# EAGLE design stm32f4-discovery-breakout-v1 (EAGLE 6.5.0)
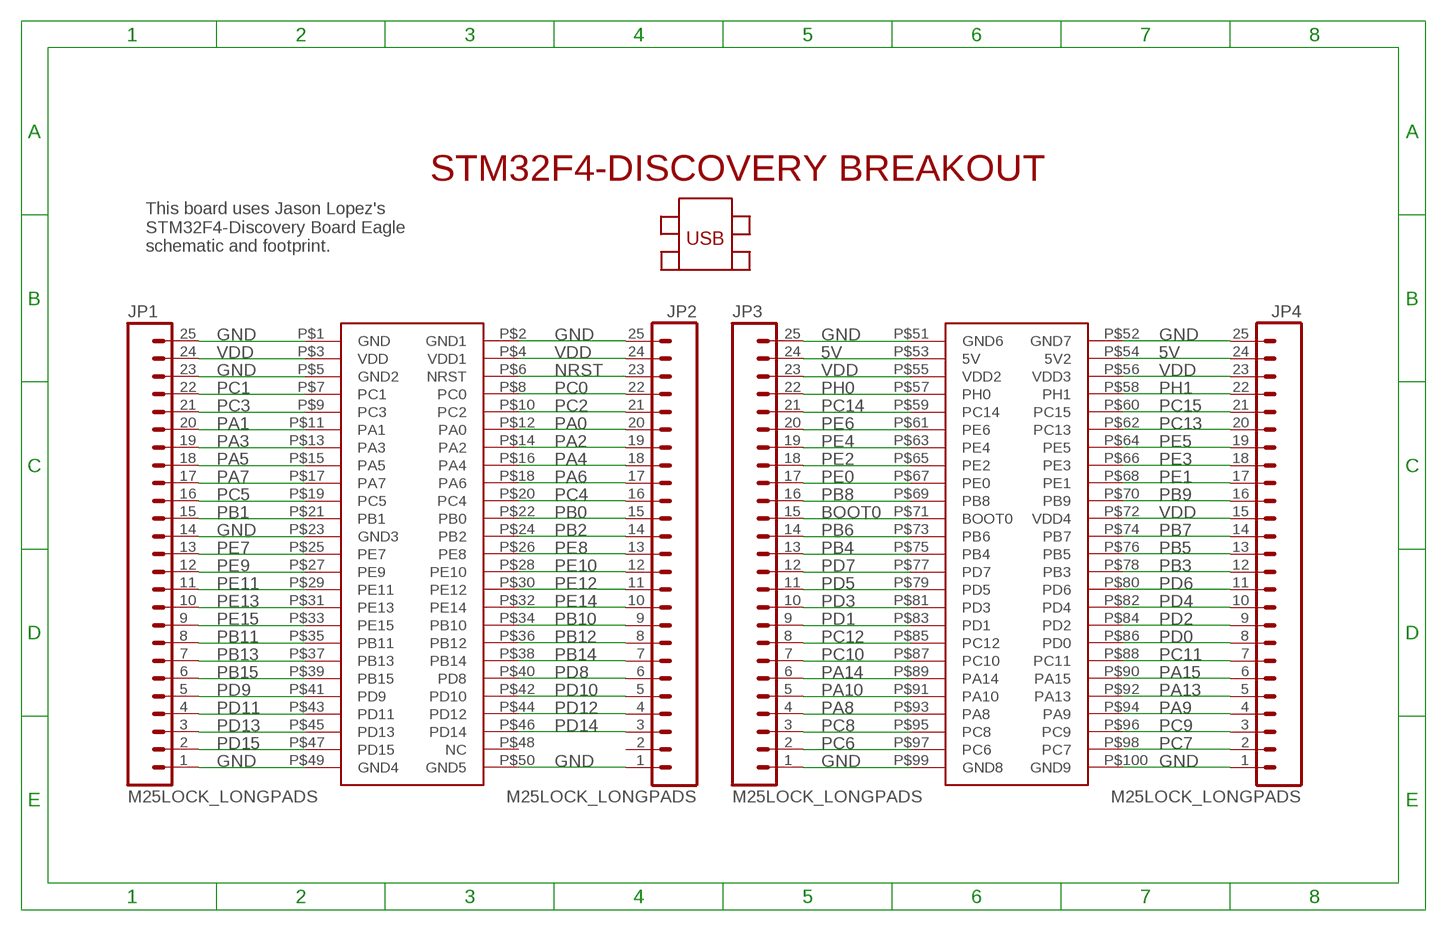
[diagram p0: schematic, sheet 1]

## Parts
JP1  M25LOCK_LONGPADS  [1X25_LOCK_LONGPADS]
JP2  M25LOCK_LONGPADS  [1X25_LOCK_LONGPADS]
JP3  M25LOCK_LONGPADS  [1X25_LOCK_LONGPADS]
JP4  M25LOCK_LONGPADS  [1X25_LOCK_LONGPADS]
U$1  STM32F4-DISCOVERY  [STM32F4-DISCOVERY]

## Nets
5V: JP3.24 JP4.24 U$1.P$53(5V) U$1.P$54(5V2)
BOOT0: JP3.15 U$1.P$71(BOOT0)
GND: JP1.1 JP1.14 JP1.23 JP1.25 JP2.1 JP2.25 JP3.1 JP3.25 JP4.1 JP4.25 U$1.P$1(GND) U$1.P$2(GND1) U$1.P$5(GND2) U$1.P$23(GND3) U$1.P$49(GND4) U$1.P$50(GND5) U$1.P$51(GND6) U$1.P$52(GND7) U$1.P$99(GND8) U$1.P$100(GND9)
NRST: JP2.23 U$1.P$6(NRST)
PA0: JP2.20 U$1.P$12(PA0)
PA1: JP1.20 U$1.P$11(PA1)
PA2: JP2.19 U$1.P$14(PA2)
PA3: JP1.19 U$1.P$13(PA3)
PA4: JP2.18 U$1.P$16(PA4)
PA5: JP1.18 U$1.P$15(PA5)
PA6: JP2.17 U$1.P$18(PA6)
PA7: JP1.17 U$1.P$17(PA7)
PA8: JP3.4 U$1.P$93(PA8)
PA9: JP4.4 U$1.P$94(PA9)
PA10: JP3.5 U$1.P$91(PA10)
PA13: JP4.5 U$1.P$92(PA13)
PA14: JP3.6 U$1.P$89(PA14)
PA15: JP4.6 U$1.P$90(PA15)
PB0: JP2.15 U$1.P$22(PB0)
PB1: JP1.15 U$1.P$21(PB1)
PB2: JP2.14 U$1.P$24(PB2)
PB3: JP4.12 U$1.P$78(PB3)
PB4: JP3.13 U$1.P$75(PB4)
PB5: JP4.13 U$1.P$76(PB5)
PB6: JP3.14 U$1.P$73(PB6)
PB7: JP4.14 U$1.P$74(PB7)
PB8: JP3.16 U$1.P$69(PB8)
PB9: JP4.16 U$1.P$70(PB9)
PB10: JP2.9 U$1.P$34(PB10)
PB11: JP1.8 U$1.P$35(PB11)
PB12: JP2.8 U$1.P$36(PB12)
PB13: JP1.7 U$1.P$37(PB13)
PB14: JP2.7 U$1.P$38(PB14)
PB15: JP1.6 U$1.P$39(PB15)
PC0: JP2.22 U$1.P$8(PC0)
PC1: JP1.22 U$1.P$7(PC1)
PC2: JP2.21 U$1.P$10(PC2)
PC3: JP1.21 U$1.P$9(PC3)
PC4: JP2.16 U$1.P$20(PC4)
PC5: JP1.16 U$1.P$19(PC5)
PC6: JP3.2 U$1.P$97(PC6)
PC7: JP4.2 U$1.P$98(PC7)
PC8: JP3.3 U$1.P$95(PC8)
PC9: JP4.3 U$1.P$96(PC9)
PC10: JP3.7 U$1.P$87(PC10)
PC11: JP4.7 U$1.P$88(PC11)
PC12: JP3.8 U$1.P$85(PC12)
PC13: JP4.20 U$1.P$62(PC13)
PC14: JP3.21 U$1.P$59(PC14)
PC15: JP4.21 U$1.P$60(PC15)
PD0: JP4.8 U$1.P$86(PD0)
PD1: JP3.9 U$1.P$83(PD1)
PD2: JP4.9 U$1.P$84(PD2)
PD3: JP3.10 U$1.P$81(PD3)
PD4: JP4.10 U$1.P$82(PD4)
PD5: JP3.11 U$1.P$79(PD5)
PD6: JP4.11 U$1.P$80(PD6)
PD7: JP3.12 U$1.P$77(PD7)
PD8: JP2.6 U$1.P$40(PD8)
PD9: JP1.5 U$1.P$41(PD9)
PD10: JP2.5 U$1.P$42(PD10)
PD11: JP1.4 U$1.P$43(PD11)
PD12: JP2.4 U$1.P$44(PD12)
PD13: JP1.3 U$1.P$45(PD13)
PD14: JP2.3 U$1.P$46(PD14)
PD15: JP1.2 U$1.P$47(PD15)
PE0: JP3.17 U$1.P$67(PE0)
PE1: JP4.17 U$1.P$68(PE1)
PE2: JP3.18 U$1.P$65(PE2)
PE3: JP4.18 U$1.P$66(PE3)
PE4: JP3.19 U$1.P$63(PE4)
PE5: JP4.19 U$1.P$64(PE5)
PE6: JP3.20 U$1.P$61(PE6)
PE7: JP1.13 U$1.P$25(PE7)
PE8: JP2.13 U$1.P$26(PE8)
PE9: JP1.12 U$1.P$27(PE9)
PE10: JP2.12 U$1.P$28(PE10)
PE11: JP1.11 U$1.P$29(PE11)
PE12: JP2.11 U$1.P$30(PE12)
PE13: JP1.10 U$1.P$31(PE13)
PE14: JP2.10 U$1.P$32(PE14)
PE15: JP1.9 U$1.P$33(PE15)
PH0: JP3.22 U$1.P$57(PH0)
PH1: JP4.22 U$1.P$58(PH1)
VDD: JP1.24 JP2.24 JP3.23 JP4.15 JP4.23 U$1.P$3(VDD) U$1.P$4(VDD1) U$1.P$55(VDD2) U$1.P$56(VDD3) U$1.P$72(VDD4)
Unconnected: JP2.2 U$1.P$48(NC)

## Notes on the sheet
- This board uses Jason Lopez's
  STM32F4-Discovery Board Eagle 
  schematic and footprint.

## Library data of the parts
JP1-JP4 = SparkFun-Connectors:M25: 1x25 .1" header
U$1 = STM32F4-DISCOVERY:STM32F4-DISCOVERY

## Board
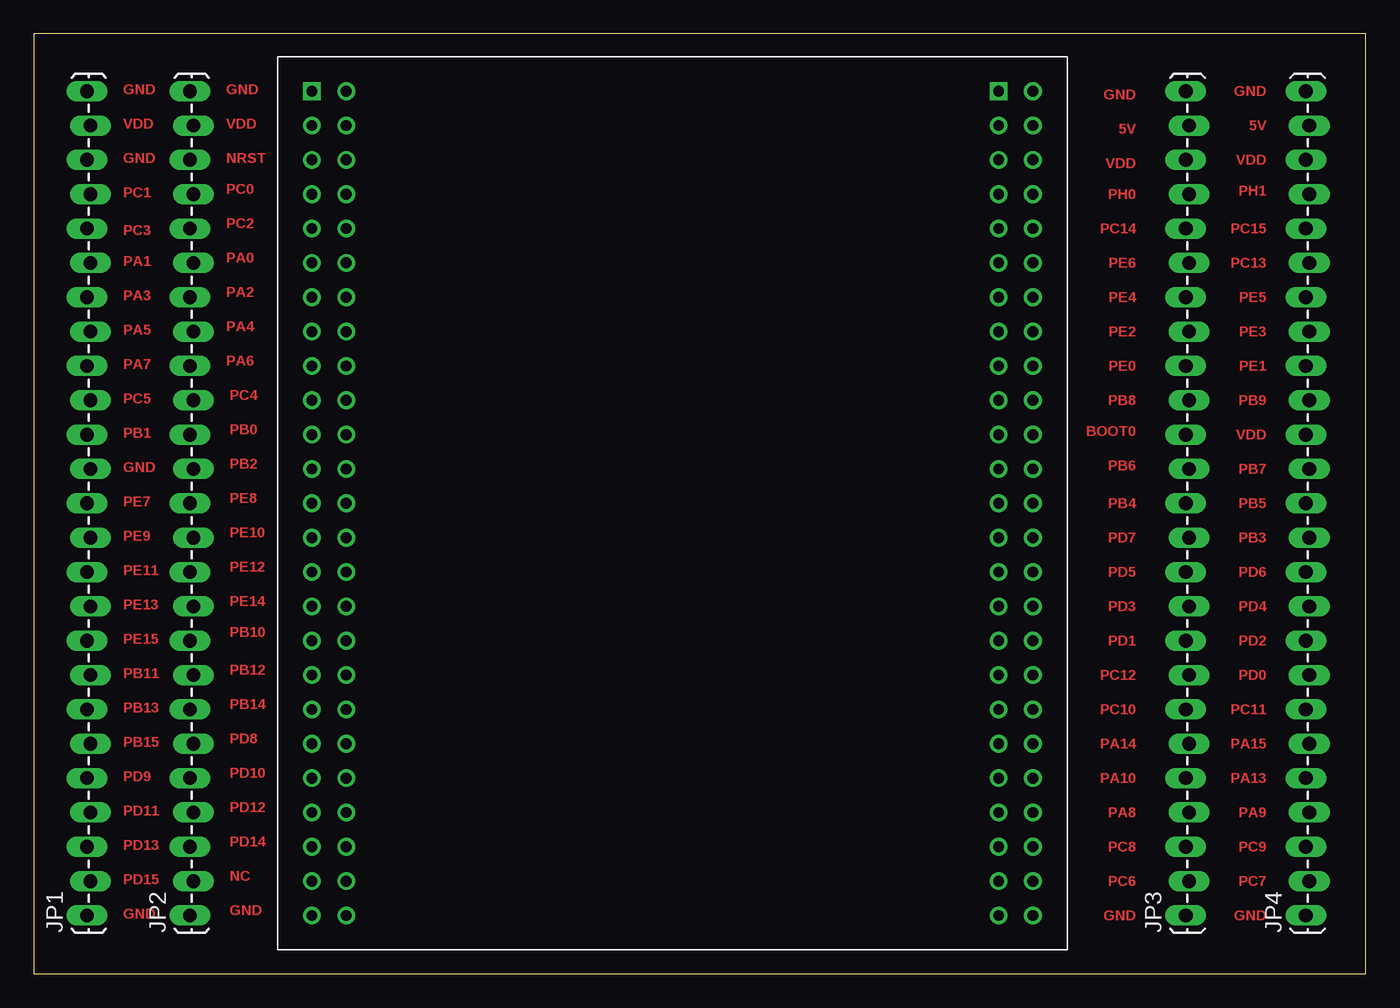
[diagram p1: board, top side]
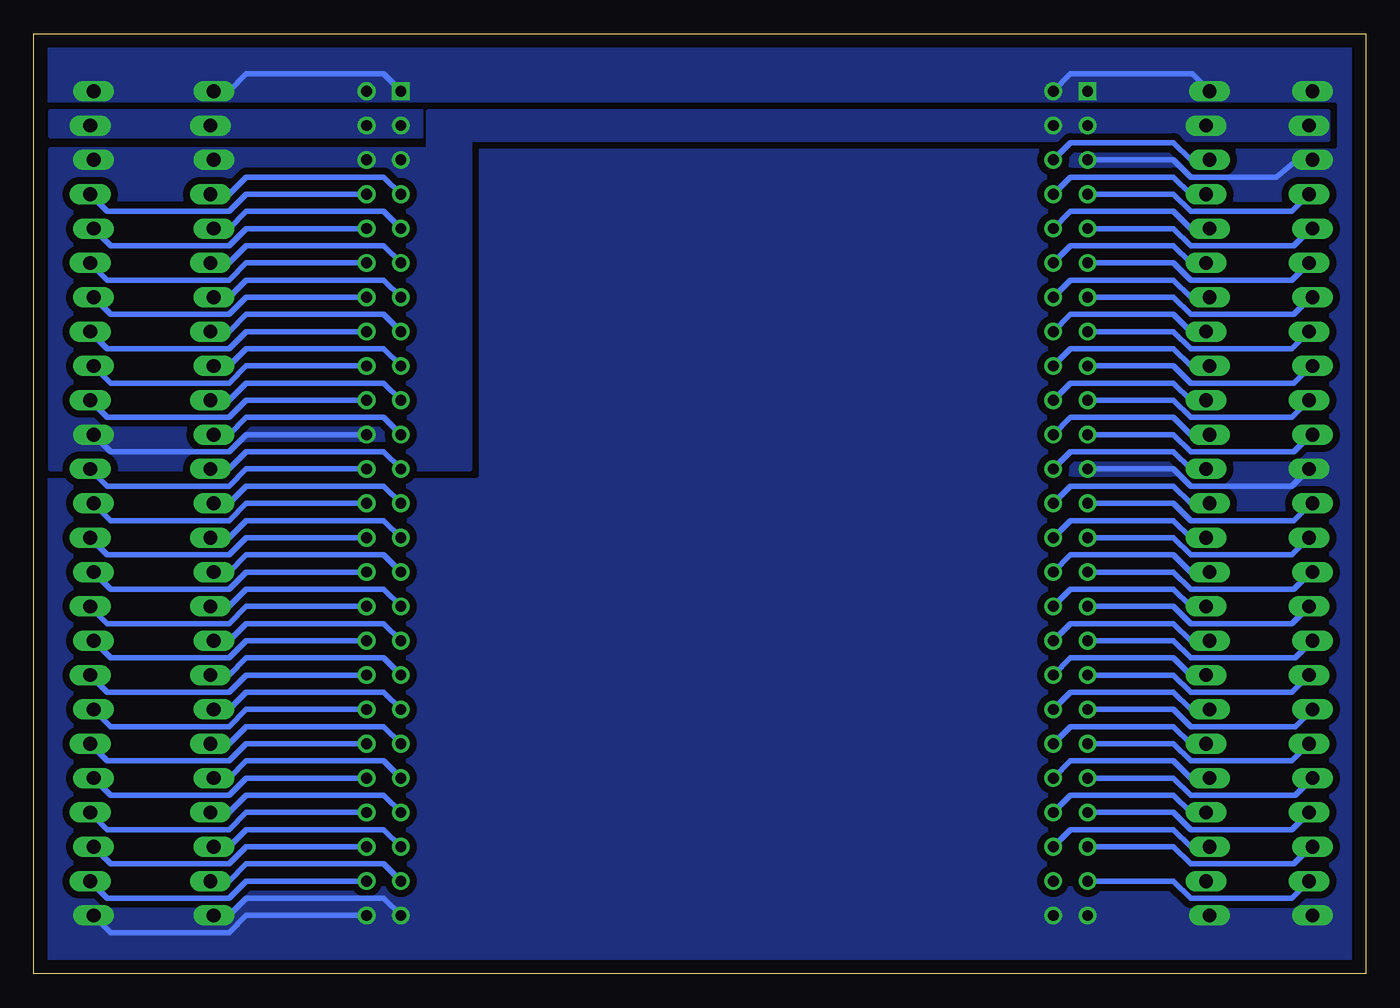
[diagram p2: board, bottom side, seen from below]

Size 98.53 x 69.52 mm. Coordinates in mm from the lower left corner, seen from the top.
Outline: 0,0 98.53,0 98.53,69.52 0,69.52 0,0
Copper layers (1*16): Top 0.035mm / dielectric 1.5mm / Bottom 0.035mm
Design rules "default": minimum track width 10mil, minimum drill 24mil, track to track 8mil, track to pad 8mil, pad to pad 8mil, via to via 8mil, smd to smd 8mil, copper to edge 40mil, drill to drill 8mil, minimum pad ring 10mil, minimum via ring 8mil, stop-mask expansion 4mil, vias tented up to drill 0mil, thermal gap 10mil

### Footprints (pad centres in the part's own frame; a part is rotated, then mirrored left to right if it is on the bottom)
1X25_LOCK_LONGPADS = drill 1.016 long: 1 0,0.127; 2 2.54,-0.127; 3 5.08,0.127; 4 7.62,-0.127; 5 10.16,0.127; 6 12.7,-0.127; 7 15.24,0.127; 8 17.78,-0.127; 9 20.32,0.127; 10 22.86,-0.127; 11 25.4,0.127; 12 27.94,-0.127; 13 30.48,0.127; 14 33.02,-0.127; 15 35.56,0.127; 16 38.1,-0.127; 17 40.64,0.127; 18 43.18,-0.127; 19 45.72,0.127; 20 48.26,-0.127; 21 50.8,0.127; 22 53.34,-0.127; 23 55.88,0.127; 24 58.42,-0.127; 25 60.96,0.127
STM32F4-DISCOVERY = drill 0.8 square: P$1 -27.94,30.48; P$51 22.86,30.48 | drill 0.8: P$2 -25.4,30.48; P$3 -27.94,27.94; P$4 -25.4,27.94; P$5 -27.94,25.4; P$6 -25.4,25.4; P$7 -27.94,22.86; P$8 -25.4,22.86; P$9 -27.94,20.32; P$10 -25.4,20.32; P$11 -27.94,17.78; P$12 -25.4,17.78; P$13 -27.94,15.24; P$14 -25.4,15.24; P$15 -27.94,12.7; P$16 -25.4,12.7; P$17 -27.94,10.16; P$18 -25.4,10.16; P$19 -27.94,7.62; P$20 -25.4,7.62; P$21 -27.94,5.08; P$22 -25.4,5.08; P$23 -27.94,2.54; P$24 -25.4,2.54; P$25 -27.94,0; P$26 -25.4,0; P$27 -27.94,-2.54; P$28 -25.4,-2.54; P$29 -27.94,-5.08; P$30 -25.4,-5.08; P$31 -27.94,-7.62; P$32 -25.4,-7.62; P$33 -27.94,-10.16; P$34 -25.4,-10.16; P$35 -27.94,-12.7; P$36 -25.4,-12.7; P$37 -27.94,-15.24; P$38 -25.4,-15.24; P$39 -27.94,-17.78; P$40 -25.4,-17.78; P$41 -27.94,-20.32; P$42 -25.4,-20.32; P$43 -27.94,-22.86; P$44 -25.4,-22.86; P$45 -27.94,-25.4; P$46 -25.4,-25.4; P$47 -27.94,-27.94; P$48 -25.4,-27.94; P$49 -27.94,-30.48; P$50 -25.4,-30.48; P$52 25.4,30.48; P$53 22.86,27.94; P$54 25.4,27.94; P$55 22.86,25.4; P$56 25.4,25.4; P$57 22.86,22.86; P$58 25.4,22.86; P$59 22.86,20.32; P$60 25.4,20.32; P$61 22.86,17.78; P$62 25.4,17.78; P$63 22.86,15.24; P$64 25.4,15.24; P$65 22.86,12.7; P$66 25.4,12.7; P$67 22.86,10.16; P$68 25.4,10.16; P$69 22.86,7.62; P$70 25.4,7.62; P$71 22.86,5.08; P$72 25.4,5.08; P$73 22.86,2.54; P$74 25.4,2.54; P$75 22.86,0; P$76 25.4,0; P$77 22.86,-2.54; P$78 25.4,-2.54; P$79 22.86,-5.08; P$80 25.4,-5.08; P$81 22.86,-7.62; P$82 25.4,-7.62; P$83 22.86,-10.16; P$84 25.4,-10.16; P$85 22.86,-12.7; P$86 25.4,-12.7; P$87 22.86,-15.24; P$88 25.4,-15.24; P$89 22.86,-17.78; P$90 25.4,-17.78; P$91 22.86,-20.32; P$92 25.4,-20.32; P$93 22.86,-22.86; P$94 25.4,-22.86; P$95 22.86,-25.4; P$96 25.4,-25.4; P$97 22.86,-27.94; P$98 25.4,-27.94; P$99 22.86,-30.48; P$100 25.4,-30.48

### Placement (x,y rotation side)
JP1  4.06,4.32 90 top
JP2  11.68,4.32 90 top
JP3  85.34,4.32 90 top
JP4  94.23,4.32 90 top
U$1  48.51,34.8 0 top

### Tracks (layer width: path | path; a pad name or v marks a point on that pad's centre or on a via)
5V
  pour Bottom (rank 2, no thermals): 69.85,63.75 69.85,61.98 97.28,61.98 97.28,63.75
BOOT0
  Bottom 0.406: U$1.P$71 72.64,41.15 82.8,41.15 84.07,39.88 JP3.15
GND
  Bottom 0.406: U$1.P$2 21.84,66.55 12.83,66.55 JP2.25 | U$1.P$23 14.22,37.34 12.95,36.07 5.46,36.07 JP1.14 | U$1.P$100 82.8,4.32 84.07,3.05 92.84,3.05 JP4.1 | U$1.P$99 72.64,5.59 82.8,5.59 84.07,4.32 JP3.1 | U$1.P$51 72.64,66.55 82.8,66.55 84.07,65.28 JP3.25 | U$1.P$5 14.22,60.2 12.95,58.93 6.6,58.93 5.08,60.2 JP1.23
  pour Bottom (isolate 0.508, rank 3, no thermals): 0.25,69.09 0.25,0.51 98.04,0.51 98.04,69.09
NRST
  Bottom 0.406: U$1.P$6 21.84,61.47 14.22,61.47 12.95,60.2 JP2.23
PA0
  Bottom 0.406: U$1.P$12 21.84,53.85 14.22,53.85 12.95,52.58 JP2.20 11.68,52.58
PA1
  Bottom 0.406: U$1.P$11 14.22,52.58 12.95,51.31 5.46,51.31 JP1.20
PA2
  Bottom 0.406: U$1.P$14 21.84,51.31 14.22,51.31 12.95,50.04 JP2.19
PA3
  Bottom 0.406: U$1.P$13 14.22,50.04 12.95,48.77 5.33,48.77 4.06,50.04 JP1.19
PA4
  Bottom 0.406: U$1.P$16 21.84,48.77 14.22,48.77 12.95,47.5 JP2.18 11.68,47.5
PA5
  Bottom 0.406: U$1.P$15 14.22,47.5 12.95,46.23 5.46,46.23 JP1.18
PA6
  Bottom 0.406: U$1.P$18 21.84,46.23 14.22,46.23 12.95,44.96 JP2.17
PA7
  Bottom 0.406: U$1.P$17 14.22,44.96 12.95,43.69 5.33,43.69 4.06,44.96 JP1.17
PA8
  Bottom 0.406: U$1.P$93 72.64,13.21 82.8,13.21 84.07,11.94 JP3.4
PA9
  Bottom 0.406: U$1.P$94 82.8,11.94 84.07,10.67 93.09,10.67 JP4.4
PA10
  Bottom 0.406: U$1.P$91 72.64,15.75 82.8,15.75 84.07,14.48 JP3.5
PA13
  Bottom 0.406: U$1.P$92 82.8,14.48 84.07,13.21 92.84,13.21 JP4.5
PA14
  Bottom 0.406: U$1.P$89 72.64,18.29 82.8,18.29 84.07,17.02 JP3.6
PA15
  Bottom 0.406: U$1.P$90 82.8,17.02 84.07,15.75 93.09,15.75 JP4.6
PB0
  Bottom 0.406: U$1.P$22 21.84,41.15 14.22,41.15 12.95,39.88 JP2.15
PB1
  Bottom 0.406: U$1.P$21 14.22,39.88 12.95,38.61 5.33,38.61 4.06,39.88 JP1.15
PB2
  Bottom 0.406: U$1.P$24 21.84,38.61 14.22,38.61 12.95,37.34 JP2.14
PB3
  Bottom 0.406: U$1.P$78 82.8,32.26 84.07,30.99 93.09,30.99 JP4.12
PB4
  Bottom 0.406: U$1.P$75 72.64,36.07 82.8,36.07 84.07,34.8 JP3.13
PB5
  Bottom 0.406: U$1.P$76 82.8,34.8 84.07,33.53 92.84,33.53 JP4.13
PB6
  Bottom 0.406: U$1.P$73 72.64,38.61 82.8,38.61 84.07,37.34 JP3.14
PB7
  Bottom 0.406: U$1.P$74 82.8,37.34 84.07,36.07 93.09,36.07 JP4.14
PB8
  Bottom 0.406: U$1.P$69 72.64,43.69 82.8,43.69 84.07,42.42 JP3.16
PB9
  Bottom 0.406: U$1.P$70 82.8,42.42 84.07,41.15 93.09,41.15 JP4.16
PB10
  Bottom 0.406: U$1.P$34 21.84,25.91 14.22,25.91 12.95,24.64 JP2.9
PB11
  Bottom 0.406: U$1.P$35 14.22,22.1 12.95,20.83 5.46,20.83 JP1.8
PB12
  Bottom 0.406: U$1.P$36 21.84,23.37 14.22,23.37 12.95,22.1 JP2.8
PB13
  Bottom 0.406: U$1.P$37 14.22,19.56 12.95,18.29 5.21,18.29 JP1.7
PB14
  Bottom 0.406: U$1.P$38 21.84,20.83 14.22,20.83 12.95,19.56 JP2.7
PB15
  Bottom 0.406: U$1.P$39 14.22,17.02 12.95,15.75 5.46,15.75 JP1.6
PC0
  Bottom 0.406: U$1.P$8 21.84,58.93 14.22,58.93 12.95,57.66 JP2.22
PC1
  Bottom 0.406: U$1.P$7 14.22,57.66 12.95,56.39 5.46,56.39 JP1.22
PC2
  Bottom 0.406: U$1.P$10 21.84,56.39 14.22,56.39 12.95,55.12 JP2.21
PC3
  Bottom 0.406: U$1.P$9 14.22,55.12 12.95,53.85 5.33,53.85 4.06,55.12 JP1.21
PC4
  Bottom 0.406: U$1.P$20 21.84,43.69 14.22,43.69 12.95,42.42 JP2.16
PC5
  Bottom 0.406: U$1.P$19 14.22,42.42 12.95,41.15 5.46,41.15 JP1.16
PC6
  Bottom 0.406: U$1.P$97 72.64,8.13 82.8,8.13 84.07,6.86 JP3.2
PC7
  Bottom 0.406: U$1.P$98 82.8,6.86 84.07,5.59 93.09,5.59 JP4.2
PC8
  Bottom 0.406: U$1.P$95 72.64,10.67 82.8,10.67 84.07,9.4 JP3.3
PC9
  Bottom 0.406: U$1.P$96 82.8,9.4 84.07,8.13 92.84,8.13 JP4.3
PC10
  Bottom 0.406: U$1.P$87 72.64,20.83 82.8,20.83 84.07,19.56 JP3.7 85.34,19.56
PC11
  Bottom 0.406: U$1.P$88 82.8,19.56 84.07,18.29 92.84,18.29 JP4.7
PC12
  Bottom 0.406: U$1.P$85 72.64,23.37 82.8,23.37 84.07,22.1 JP3.8
PC13
  Bottom 0.406: U$1.P$62 82.8,52.58 84.07,51.31 93.09,51.31 JP4.20
PC14
  Bottom 0.406: U$1.P$59 72.64,56.39 82.8,56.39 84.07,55.12 JP3.21
PC15
  Bottom 0.406: U$1.P$60 82.8,55.12 84.07,53.85 92.84,53.85 JP4.21
PD0
  Bottom 0.406: U$1.P$86 82.8,22.1 84.07,20.83 93.09,20.83 JP4.8
PD1
  Bottom 0.406: U$1.P$83 72.64,25.91 82.8,25.91 84.07,24.64 JP3.9
PD2
  Bottom 0.406: U$1.P$84 82.8,24.64 84.07,23.37 92.84,23.37 JP4.9
PD3
  Bottom 0.406: U$1.P$81 72.64,28.45 82.8,28.45 84.07,27.18 JP3.10
PD4
  Bottom 0.406: U$1.P$82 82.8,27.18 84.07,25.91 93.09,25.91 JP4.10
PD5
  Bottom 0.406: U$1.P$79 72.64,30.99 82.8,30.99 84.07,29.72 JP3.11
PD6
  Bottom 0.406: U$1.P$80 82.8,29.72 84.07,28.45 92.84,28.45 JP4.11
PD7
  Bottom 0.406: U$1.P$77 72.64,33.53 82.8,33.53 84.07,32.26 JP3.12
PD8
  Bottom 0.406: U$1.P$40 21.84,18.29 14.22,18.29 12.95,17.02 JP2.6
PD9
  Bottom 0.406: U$1.P$41 14.22,14.48 12.95,13.21 5.21,13.21 JP1.5
PD10
  Bottom 0.406: U$1.P$42 21.84,15.75 14.22,15.75 12.95,14.48 JP2.5
PD11
  Bottom 0.406: U$1.P$43 14.22,11.94 12.95,10.67 5.46,10.67 JP1.4
PD12
  Bottom 0.406: U$1.P$44 21.84,13.21 14.22,13.21 12.95,11.94 JP2.4
PD13
  Bottom 0.406: U$1.P$45 14.22,9.4 12.95,8.13 5.33,8.13 4.06,9.4 JP1.3
PD14
  Bottom 0.406: U$1.P$46 21.84,10.67 14.22,10.67 12.95,9.4 JP2.3
PD15
  Bottom 0.406: U$1.P$47 14.22,6.86 12.95,5.59 5.46,5.59 JP1.2
PE0
  Bottom 0.406: U$1.P$67 72.64,46.23 82.8,46.23 84.07,44.96 JP3.17
PE1
  Bottom 0.406: U$1.P$68 82.8,44.96 84.07,43.69 92.84,43.69 JP4.17
PE2
  Bottom 0.406: U$1.P$65 72.64,48.77 82.8,48.77 84.07,47.5 JP3.18
PE3
  Bottom 0.406: U$1.P$66 82.8,47.5 84.07,46.23 93.09,46.23 JP4.18
PE4
  Bottom 0.406: U$1.P$63 72.64,51.31 82.8,51.31 84.07,50.04 JP3.19
PE5
  Bottom 0.406: U$1.P$64 82.8,50.04 84.07,48.77 92.84,48.77 JP4.19
PE6
  Bottom 0.406: U$1.P$61 72.64,53.85 82.8,53.85 84.07,52.58 JP3.20
PE7
  Bottom 0.406: U$1.P$25 14.22,34.8 12.95,33.53 5.33,33.53 4.06,34.8 JP1.13
PE8
  Bottom 0.406: U$1.P$26 21.84,36.07 14.22,36.07 12.95,34.8 JP2.13
PE9
  Bottom 0.406: U$1.P$27 14.22,32.26 12.95,30.99 5.46,30.99 JP1.12
PE10
  Bottom 0.406: U$1.P$28 21.84,33.53 14.22,33.53 12.95,32.26 JP2.12
PE11
  Bottom 0.406: U$1.P$29 14.22,29.72 12.95,28.45 5.33,28.45 4.06,29.72 JP1.11
PE12
  Bottom 0.406: U$1.P$30 21.84,30.99 14.22,30.99 12.95,29.72 JP2.11
PE13
  Bottom 0.406: U$1.P$31 14.22,27.18 12.95,25.91 5.46,25.91 JP1.10
PE14
  Bottom 0.406: U$1.P$32 21.84,28.45 14.22,28.45 12.95,27.18 JP2.10
PE15
  Bottom 0.406: U$1.P$33 14.22,24.64 12.95,23.37 5.21,23.37 JP1.9
PH0
  Bottom 0.406: U$1.P$57 72.64,58.93 82.8,58.93 84.07,57.66 JP3.22
PH1
  Bottom 0.406: U$1.P$58 82.8,57.66 84.07,56.39 93.09,56.39 JP4.22
VDD
  Bottom 0.406: U$1.P$72 82.8,39.88 84.07,38.61 92.84,38.61 JP4.15
  pour Bottom (isolate 0.508, no thermals): 69.34,60.96 97.28,60.96 97.28,37.34 66.29,37.34 66.29,61.72 2.79,61.72 2.79,63.75 69.34,63.75

### Text on the board
Top: GND | GND | GND | GND | 5V | VDD | VDD | 5V | GND | NRST | VDD | VDD | PC0 | PH0 | PH1 | PC1 | PC3 | PC2 | PC14 | PC15 | PA0 | PE6 | PC13 | PA1 | PA3 | PA2 | PE4 | PE5 | PA5 | PA4 | PE2 | PE3 | PA7 | PA6 | PE0 | PE1 | PC5 | PC4 | PB8 | PB9 | PB1 | PB0 | BOOT0 | VDD | PB6 | GND | PB2 | PB7 | PE7 | PE8 | PB4 | PB5 | PE9 | PE10 | PD7 | PB3 | PE12 | PD5 | PD6 | PE11 | PE13 | PE14 | PD3 | PD4 | PB10 | PD1 | PD2 | PE15 | PB11 | PB12 | PC12 | PD0 | PB14 | PC10 | PC11 | PB13 | PB15 | PD8 | PA14 | PA15 | PD9 | PD10 | PA10 | PA13 | PD11 | PD12 | PA8 | PA9 | PD13 | PD14 | PC8 | PC9 | PD15 | NC | PC6 | PC7 | GND | GND | GND | GND